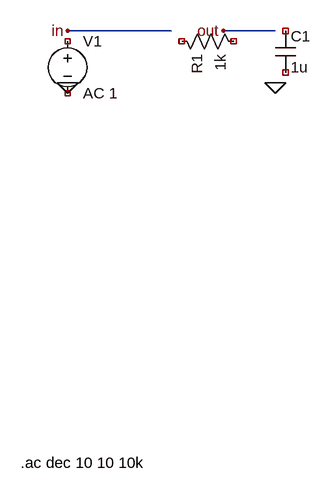
[diagram p0: schematic netlist_case.asc]
netlist_case.asc, the LTspice schematic file:
Version 4
SHEET 1 1200 900
WIRE 120 96 280 96
WIRE 360 96 440 96
FLAG 120 96 in
FLAG 120 176 0
FLAG 440 176 0
FLAG 360 96 out
SYMBOL voltage 120 96 R0
SYMATTR InstName V1
SYMATTR Value AC 1
SYMBOL res 280 96 M90
SYMATTR InstName R1
SYMATTR Value 1k
SYMBOL cap 440 96 R0
SYMATTR InstName C1
SYMATTR Value 1u
TEXT 48 760 Left 2 !.ac dec 10 10 10k

The netlist it stands for:
* netlist_case.asc
V1 NC_01 NC_02 AC 1
R1 NC_03 NC_04 1k
C1 NC_05 NC_06 1u
.ac dec 10 10 10k
.backanno
.end